# EAGLE design DinoCalcPCB (EAGLE 6.4)
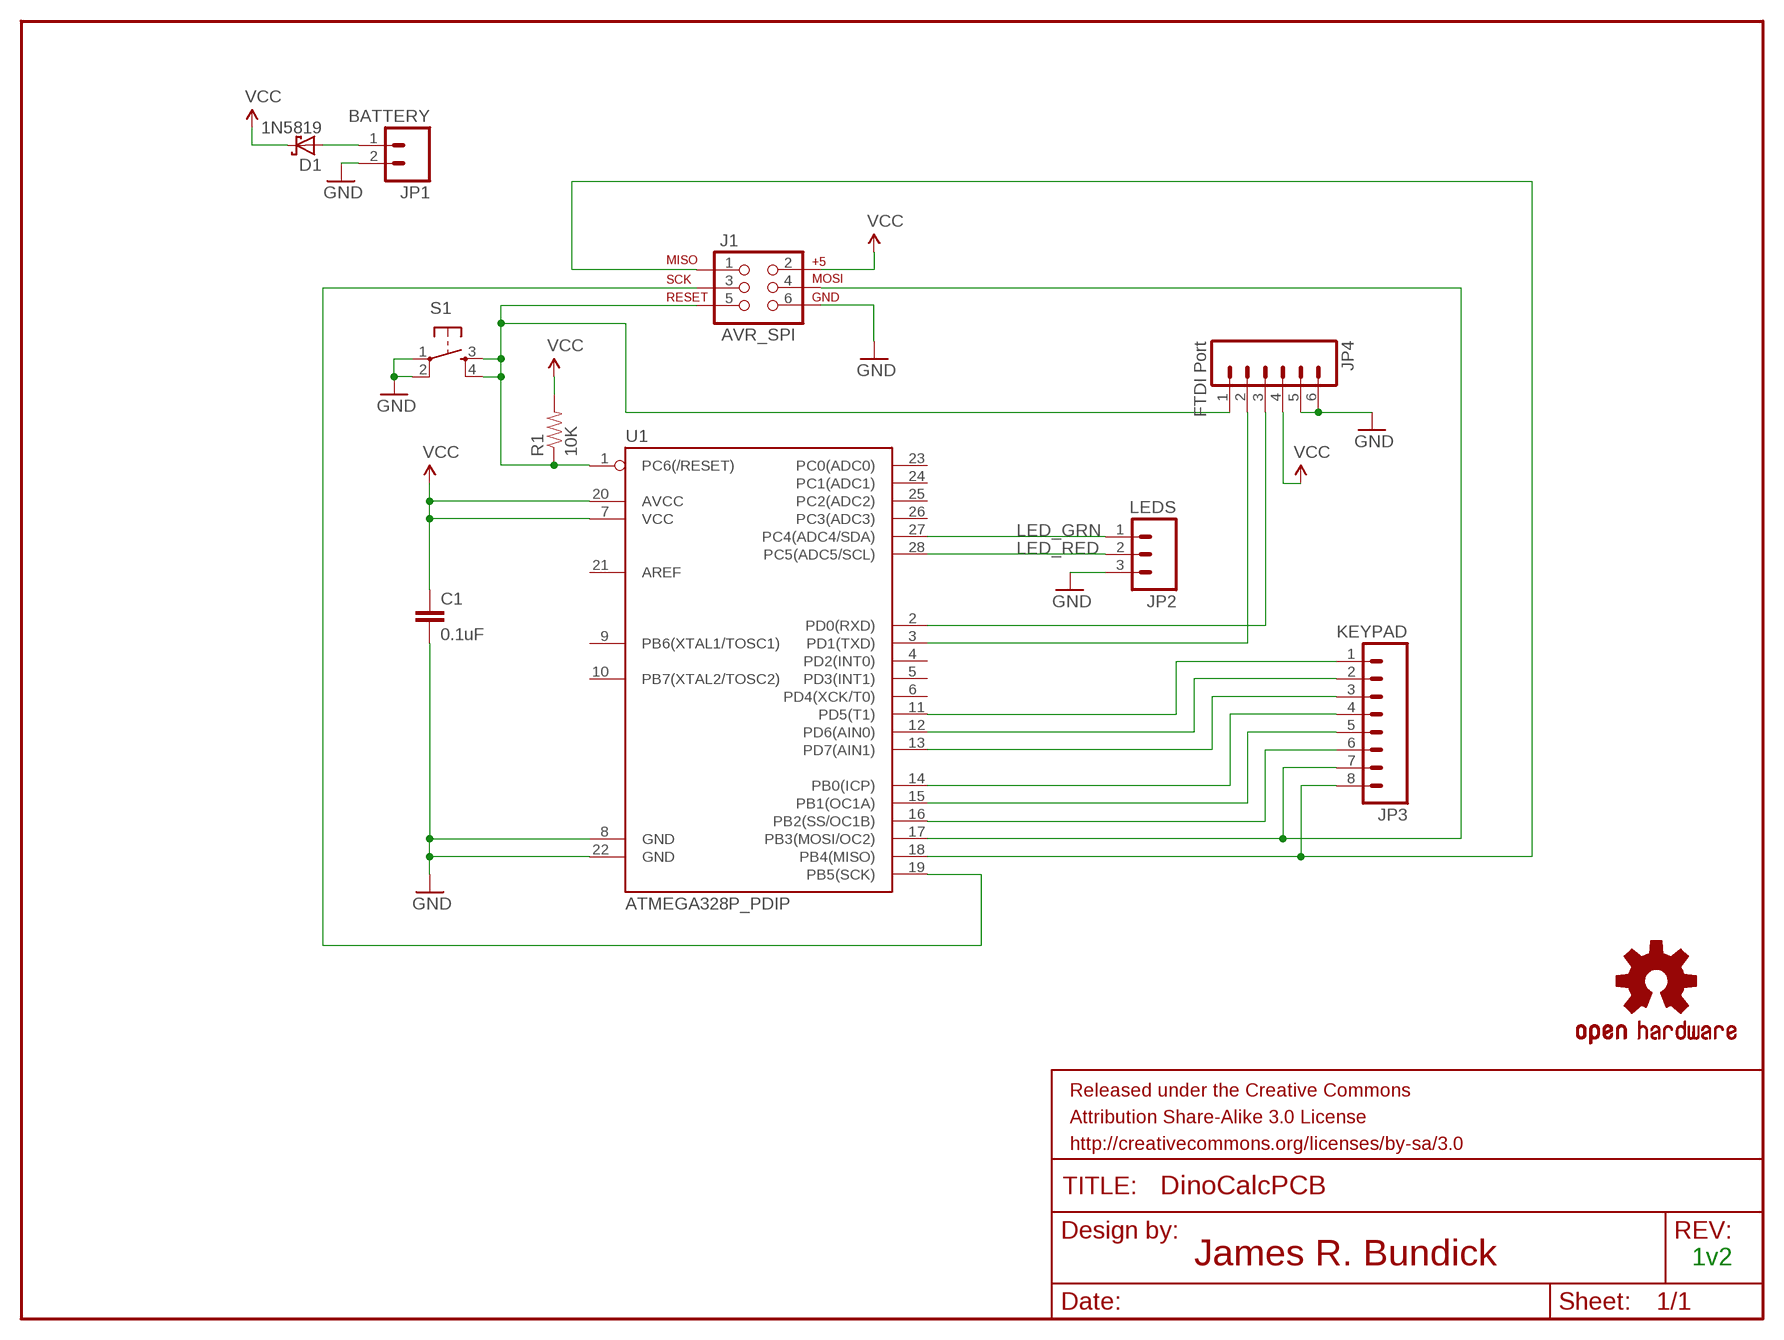
[diagram p0: schematic, sheet 1]

## Parts
C1  0.1uF  CAPPTH  [CAP-PTH-SMALL]
D1  1N5819  SCHOTTKY-DIODECB417-15  [CB417-15]
FRAME1  FRAME-LETTER  [CREATIVE_COMMONS]
J1  AVR_SPI  AVR_SPI_PRG_6OFFSET_PADS  [2X3_OFFSET]
JP1  BATTERY  M02PTH  [1X02]
JP2  LEDS  M03PTH  [1X03]
JP3  KEYPAD  M081X08  [1X08]
JP4  FTDI Port  M06LONGPADS  [1X06_LONGPADS]
LOGO1  OSHW-LOGOL  [OSHW-LOGO-L]
R1  10K  RESISTORPTH-1/4W  [AXIAL-0.4]
S1  TAC_SWITCHPTH  [TACTILE-PTH]
U1  ATMEGA328P_PDIP  [DIL28-3]

## Nets
GND: C1.2 J1.6 JP1.2 JP2.3 JP4.5 JP4.6 S1.1 S1.2 U1.8(GND) U1.22(GND)
LED_GRN: JP2.1 U1.27(PC4(ADC4/SDA))
LED_RED: JP2.2 U1.28(PC5(ADC5/SCL))
N$1: JP4.3 U1.2(PD0(RXD))
N$2: JP4.2 U1.3(PD1(TXD))
N$3: JP3.1 U1.11(PD5(T1))
N$4: JP3.2 U1.12(PD6(AIN0))
N$5: JP3.3 U1.13(PD7(AIN1))
N$6: JP3.4 U1.14(PB0(ICP))
N$7: JP3.5 U1.15(PB1(OC1A))
N$8: JP3.6 U1.16(PB2(SS/OC1B))
N$9: J1.4 JP3.7 U1.17(PB3(MOSI/OC2))
N$10: J1.1 JP3.8 U1.18(PB4(MISO))
N$11: D1.A JP1.1
N$13: J1.5 JP4.1 R1.P$1 S1.3 S1.4 U1.1(PC6(/RESET))
N$14: J1.3 U1.19(PB5(SCK))
VCC: C1.1 D1.C J1.2 JP4.4 R1.P$2 U1.7(VCC) U1.20(AVCC)
Unconnected: U1.4(PD2(INT0)) U1.5(PD3(INT1)) U1.6(PD4(XCK/T0)) U1.9(PB6(XTAL1/TOSC1)) U1.10(PB7(XTAL2/TOSC2)) U1.21(AREF) U1.23(PC0(ADC0)) U1.24(PC1(ADC1)) U1.25(PC2(ADC2)) U1.26(PC3(ADC3))

## Notes on the sheet
- 1v2

## Library data of the parts
C1 = SparkFun-Capacitors:CAP: Capacitor Standard 0603 ceramic capacitor, and 0.1" leaded capacitor.
D1 = adafruit:SCHOTTKY-DIODE: Schottky Diode
FRAME1 = SparkFun-Aesthetics:FRAME-LETTER: Schematic Frame Standard 8.5x11 US Letter frame
J1 = SparkFun-Connectors:AVR_SPI_PRG_6: AVR ISP 6 Pin This is the reduced ISP connector for AVR programming. Common on Arduino. This footprint will take up less PCB space and can be used with a 10-pin to 6-pin adapter such as SKU: BOB-08508
JP1 = SparkFun-Connectors:M02: Header 2 Standard 2-pin 0.1" header. Use with straight break away headers (SKU : PRT-00116), right angle break away headers (PRT-00553), swiss pins (PRT-00743), machine pins (PRT-00117), and female headers (PRT-00115). Molex polarized connector foot print use with SKU : PRT-08233 with associated crimp pins and housings.
JP2 = SparkFun-Connectors:M03: Header 3 Standard 3-pin 0.1" header. Use with straight break away headers (SKU : PRT-00116), right angle break away headers (PRT-00553), swiss pins (PRT-00743), machine pins (PRT-00117), and female headers (PRT-00115). Molex polarized connector foot print use with SKU : PRT-08232 with associated crimp pins and housings.
JP3 = SparkFun-Connectors:M08: Header 8 Standard 8-pin 0.1" header. Use with straight break away headers (SKU : PRT-00116), right angle break away headers (PRT-00553), swiss pins (PRT-00743), machine pins (PRT-00117), and female headers (PRT-00115).
JP4 = SparkFun-Connectors:M06: Header 6 Standard 6-pin 0.1" header. Use with straight break away headers (SKU : PRT-00116), right angle break away headers (PRT-00553), swiss pins (PRT-00743), machine pins (PRT-00117), and female headers (PRT-00115). Molex polarized connector foot print use with SKU : PRT-08094 with associated crimp pins and housings. NOTES ON THE VARIANTS LOCK and LOCK_LONGPADS... This footprint was designed to help hold the alignment of a through-hole component (i.e. 6-pin header) while soldering it into place. You may notice that each hole has been shifted either up or down by 0.005 of an inch from it's more standard position (which is a perfectly straight line). This slight alteration caused the pins (the squares in the middle) to touch the edges of the holes. Because they are alternating, it causes a "brace" to hold the component in place. 0.005 has proven to be the perfect amount of "off-center" position when using our standard breakaway headers. Although looks a little odd when you look at the bare footprint, once you have a header in there, the alteration is very hard to notice. Also, if you push a header all the way into place, it is covered up entirely on the bottom side. This idea of altering the position of holes to aid alignment will be further integrated into the Sparkfun Library for other footprints. It can help hold any component with 3 or more connection pins.
LOGO1 = SparkFun-Aesthetics:OSHW-LOGO: Open Source Hardware Logo This logo indicates the piece of hardware it is found on incorporates a OSHW license and/or adheres to the definition of open source hardware found here: http://freedomdefined.org/OSHW
R1 = SparkFun-Resistors:RESISTOR: Resistor Basic schematic elements and footprints for 0603, 1206, and PTH resistors.
S1 = SparkFun-Electromechanical:TAC_SWITCH: Momentary Switch Button commonly used for reset or general input. Spark Fun Electronics SKU : COM-00097 SMT- SWCH-08247
U1 = SparkFun-DigitalIC:ATMEGA328P_PDIP: uC used in the Arduino 32kb flash, 1k EEPROM, 2k SRAM This is the through-hole version of this chip.

## Board
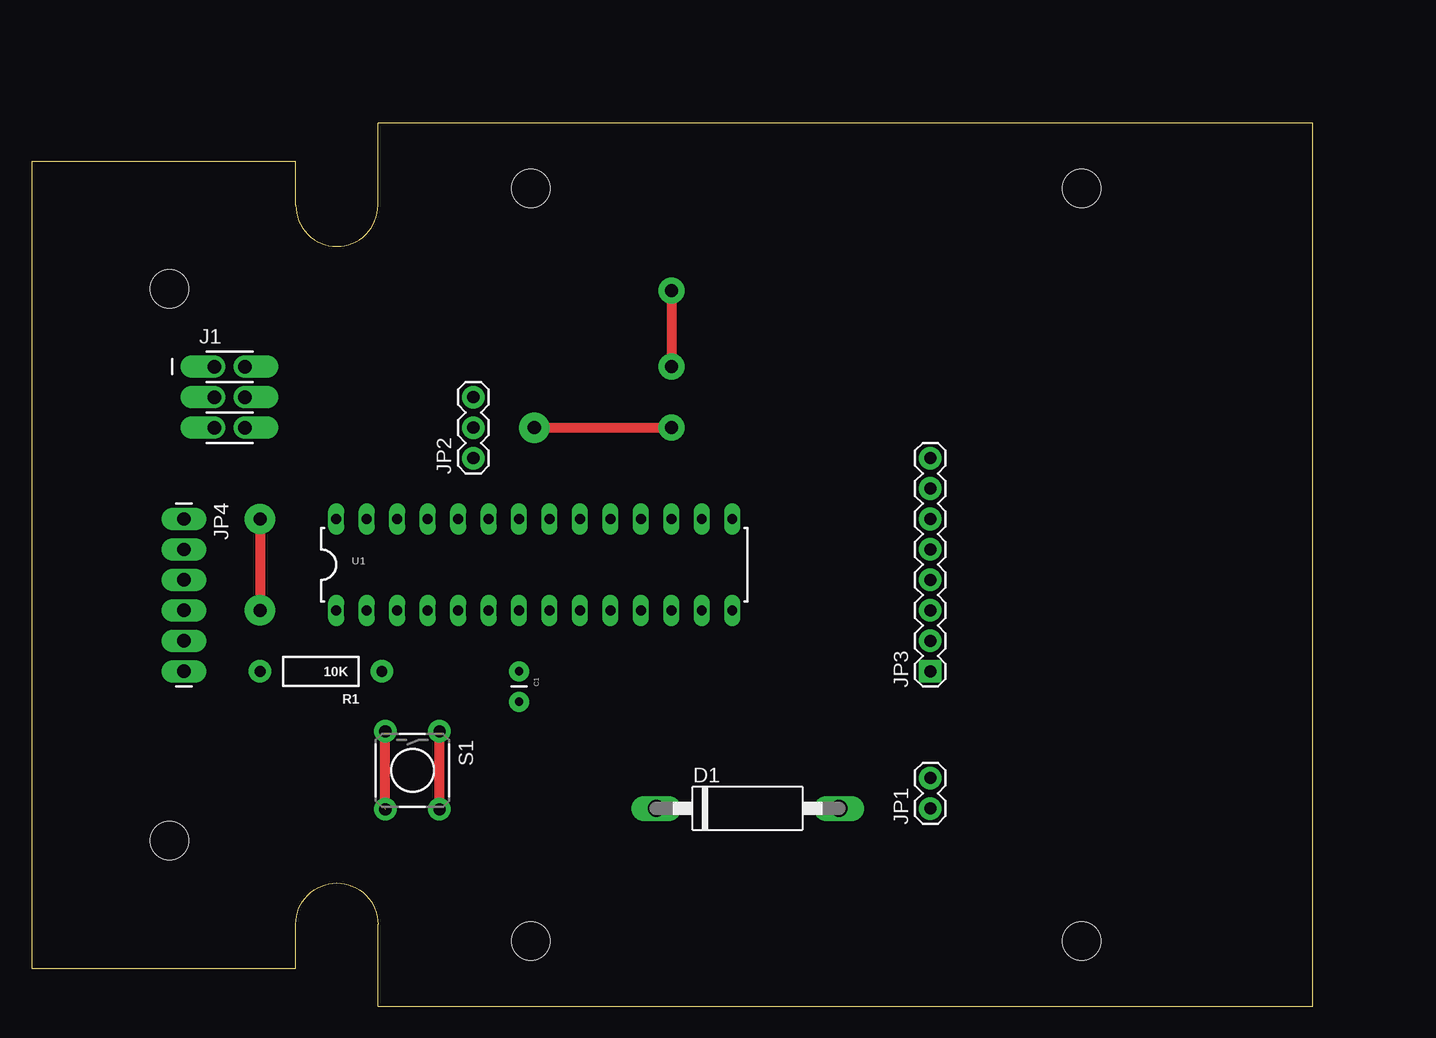
[diagram p1: board, top side]
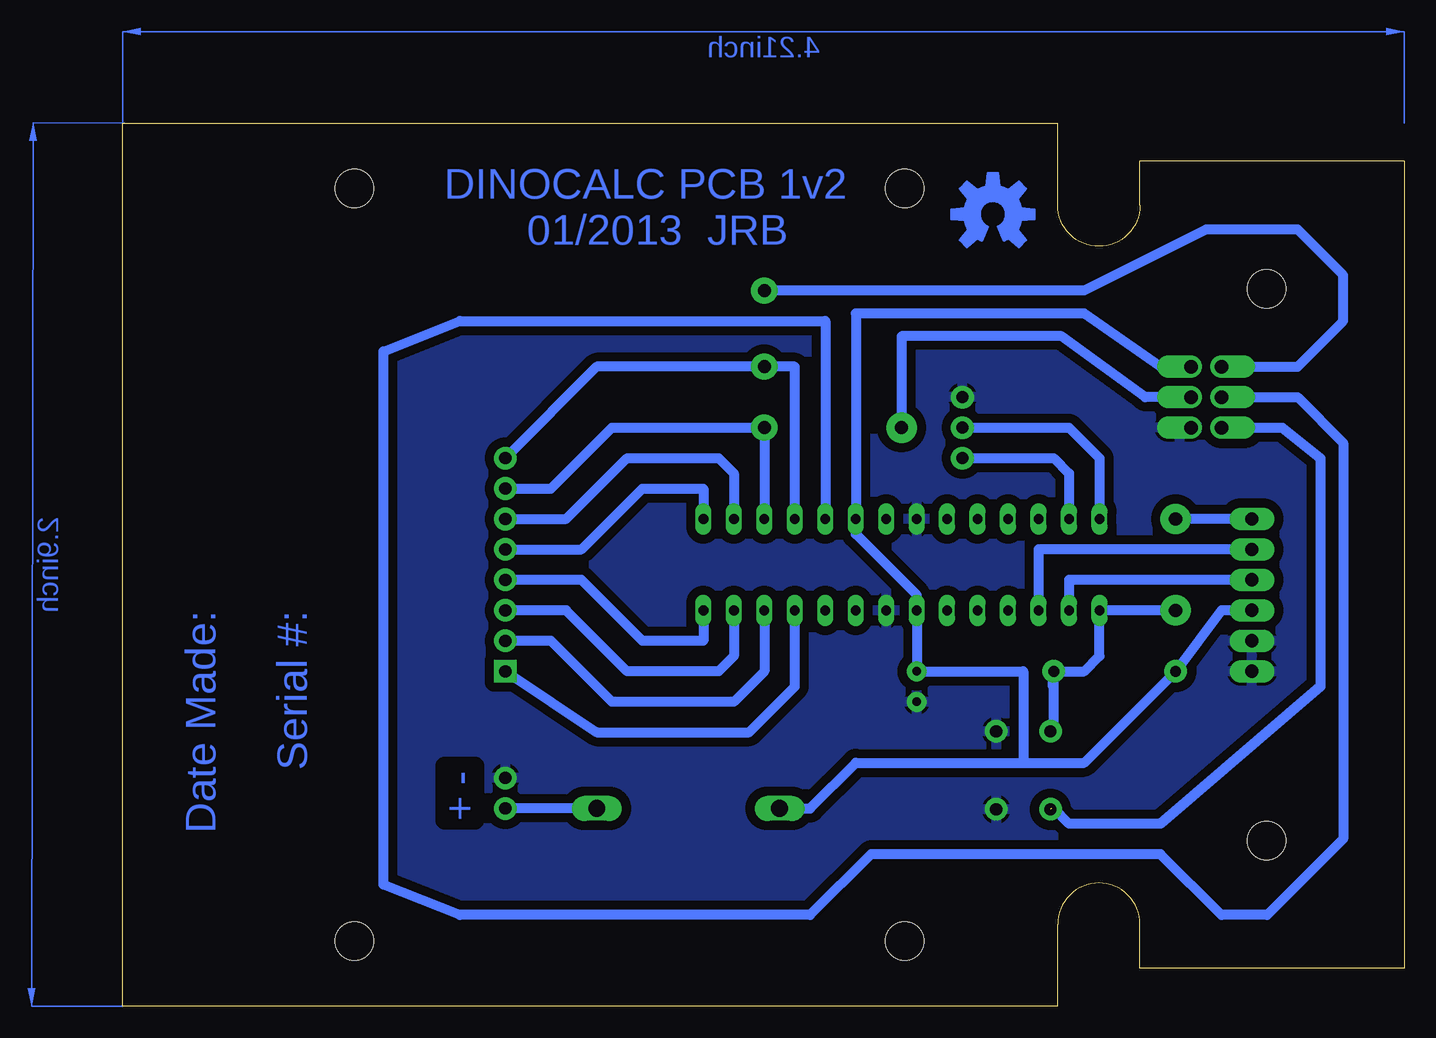
[diagram p2: board, bottom side, seen from below]

Size 106.81 x 73.66 mm. Coordinates in mm from the lower left corner, seen from the top.
Outline: 28.88,0 106.81,0 106.81,73.66 28.88,73.66 28.88,66.8 arc-180 22.02,66.8 22.02,70.48 0,70.48 0,3.17 22.02,3.17 22.02,6.86 arc-180 28.88,6.86 28.88,0
Copper layers (1*16): Top 0.035mm / dielectric 1.5mm / Bottom 0.035mm
Design rules "default *": minimum track width 10mil, minimum drill 24mil, track to track 30mil, track to pad 25mil, pad to pad 8mil, via to via 8mil, smd to smd 8mil, copper to edge 40mil, drill to drill 8mil, minimum pad ring 10mil, minimum via ring 8mil, stop-mask expansion 4mil, vias tented up to drill 0mil, thermal gap 10mil
Holes 3.2 mm at 11.48,59.84 11.48,13.82 41.63,68.2 87.53,68.2 41.63,5.46 87.53,5.46

### Footprints (pad centres in the part's own frame; a part is rotated, then mirrored left to right if it is on the bottom)
CAP-PTH-SMALL = drill 0.7 pad 1.651: 1 0,0; 2 2.54,0
CB417-15 = drill 1.397 long: A 7.62,0; C -7.62,0
2X3_OFFSET = drill 1.118 pad 1.88 offset: 1 -2.54,-1.27; 2 -2.54,1.27; 3 0,-1.27; 4 0,1.27; 5 2.54,-1.27; 6 2.54,1.27
1X02 = drill 1.016 pad 1.88: 1 0,0; 2 2.54,0
1X03 = drill 1.016 pad 1.88: 1 0,0; 2 2.54,0; 3 5.08,0
1X08 = drill 1.016 pad 1.88 square: 1 0,0 | drill 1.016 pad 1.88: 2 2.54,0; 3 5.08,0; 4 7.62,0; 5 10.16,0; 6 12.7,0; 7 15.24,0; 8 17.78,0
1X06_LONGPADS = drill 1.118 pad 1.88 long: 1 0,0; 2 2.54,0; 3 5.08,0; 4 7.62,0; 5 10.16,0; 6 12.7,0
AXIAL-0.4 = drill 0.9 pad 1.88: P$1 -5.08,0; P$2 5.08,0
TACTILE-PTH = drill 1.016 pad 1.88: 1 -3.251,2.261; 2 3.251,2.261; 3 -3.251,-2.261; 4 3.251,-2.261
DIL28-3 = drill 0.813 long: 1 -16.51,-3.81; 2 -13.97,-3.81; 3 -11.43,-3.81; 4 -8.89,-3.81; 5 -6.35,-3.81; 6 -3.81,-3.81; 7 -1.27,-3.81; 8 1.27,-3.81; 9 3.81,-3.81; 10 6.35,-3.81; 11 8.89,-3.81; 12 11.43,-3.81; 13 13.97,-3.81; 14 16.51,-3.81; 15 16.51,3.81; 16 13.97,3.81; 17 11.43,3.81; 18 8.89,3.81; 19 6.35,3.81; 20 3.81,3.81; 21 1.27,3.81; 22 -1.27,3.81; 23 -3.81,3.81; 24 -6.35,3.81; 25 -8.89,3.81; 26 -11.43,3.81; 27 -13.97,3.81; 28 -16.51,3.81

### Placement (x,y rotation side)
C1  40.64,27.94 270 top
D1  59.69,16.51 0 top
FRAME1  21.59,-8.89 0 top  (outside the outline)
J1  16.51,50.8 270 top
JP1  74.93,16.51 90 top
JP2  36.83,45.72 90 top
JP3  74.93,27.94 90 top
JP4  12.7,40.64 270 top
LOGO1  34.29,66.04 0 top
R1  24.13,27.94 180 top
S1  31.75,19.68 270 top
U1  41.91,36.83 0 top

### Tracks (layer width: path | path; a pad name or v marks a point on that pad's centre or on a via)
GND
  Top 0.813: S1.2 S1.1
  pour Bottom: 0,3.81 21.59,3.81 21.59,8.89 24.13,11.43 26.67,11.43 29.21,8.89 29.21,0 106.68,0 106.68,73.66 29.21,73.66 29.21,66.04 27.94,63.5 22.86,63.5 21.59,64.77 21.59,69.85 0,69.85
LED_GRN
  Bottom 0.813: JP2.1 29.21,45.72 27.94,44.45 U1.27
LED_RED
  Bottom 0.813: JP2.2 27.94,48.26 25.4,45.72 U1.28
N$1
  Bottom 0.813: JP4.3 27.94,35.56 U1.2
N$2
  Bottom 0.813: JP4.2 30.48,38.1 U1.3
N$3
  Bottom 0.813: JP3.1 67.31,22.86 54.61,22.86 50.8,26.67 U1.11
N$4
  Bottom 0.813: U1.12 53.34,27.94 55.88,25.4 66.04,25.4 71.12,30.48 JP3.2
N$5
  Bottom 0.813: U1.13 55.88,29.21 57.15,27.94 64.77,27.94 69.85,33.02 JP3.3
N$6
  Bottom 0.813: U1.14 58.42,30.48 63.5,30.48 68.58,35.56 JP3.4
N$7
  Bottom 0.813: JP3.5 68.58,38.1 63.5,43.18 58.42,43.18 U1.15
N$8
  Bottom 0.813: JP3.6 69.85,40.64 64.77,45.72 57.15,45.72 55.88,44.45 U1.16
N$9  (via drill 1.1 pad 2.18, 1.1 pad 2.54)
  Top 0.813: v41.91,48.26 v53.34,48.26
  Bottom 0.813: JP3.7 71.12,43.18 66.04,48.26 v53.34,48.26 U1.17 | J1.4 21.59,50.8 28.57,55.88 41.91,55.88 v41.91,48.26
N$10  (via drill 1.1 pad 2.18)
  Top 0.813: v53.34,59.69 v53.34,53.34
  Bottom 0.813: U1.18 50.8,53.34 v53.34,53.34 67.31,53.34 JP3.8 | v53.34,59.69 26.67,59.69 16.51,64.77 8.89,64.77 5.08,60.96 5.08,57.15 8.89,53.34 J1.1
N$11
  Bottom 0.813: D1.A JP1.1
N$13  (via drill 1.1 pad 2.54)  (1 unrouted)
  Top 0.813: v19.05,40.64 v19.05,33.02 | S1.4 S1.3
  Bottom 0.813: R1.P$1 26.67,27.94 25.4,29.21 U1.1 v19.05,33.02 | S1.3 29.21,23.85 R1.P$1 | 29.29,26.75 R1.P$1 | J1.5 10.16,48.26 6.99,45.72 6.99,26.67 20.32,15.24 27.94,15.24 29.21,16.51 29.41,16.51 | JP4.1 v19.05,40.64
N$14
  Bottom 0.813: J1.3 8.89,50.8 5.08,46.99 5.08,13.97 11.43,7.62 15.24,7.62 20.32,12.7 44.45,12.7 49.53,7.62 78.74,7.62 85.09,10.16 85.09,54.61 78.74,57.15 48.26,57.15 U1.19
VCC
  Bottom 0.813: JP4.4 15.24,33.02 R1.P$2 26.67,20.32 31.75,20.32 | 31.75,20.32 31.75,27.94 C1.1 U1.7 40.64,34.29 45.72,39.37 U1.20 45.72,57.78 26.67,57.78 20.32,53.34 J1.2 | D1.C 49.53,16.51 45.72,20.32 31.75,20.32
(copper drawn outside any net)
  shapes: Bottom area x2

### Text on the board
Bottom: DINOCALC PCB 1v2 / 01/2013 JRB | Date Made: / / Serial #: | - | +